# EAGLE schematic RecoveryBoard (EAGLE 9.4.2)

## Sheet 1 of 2: Power
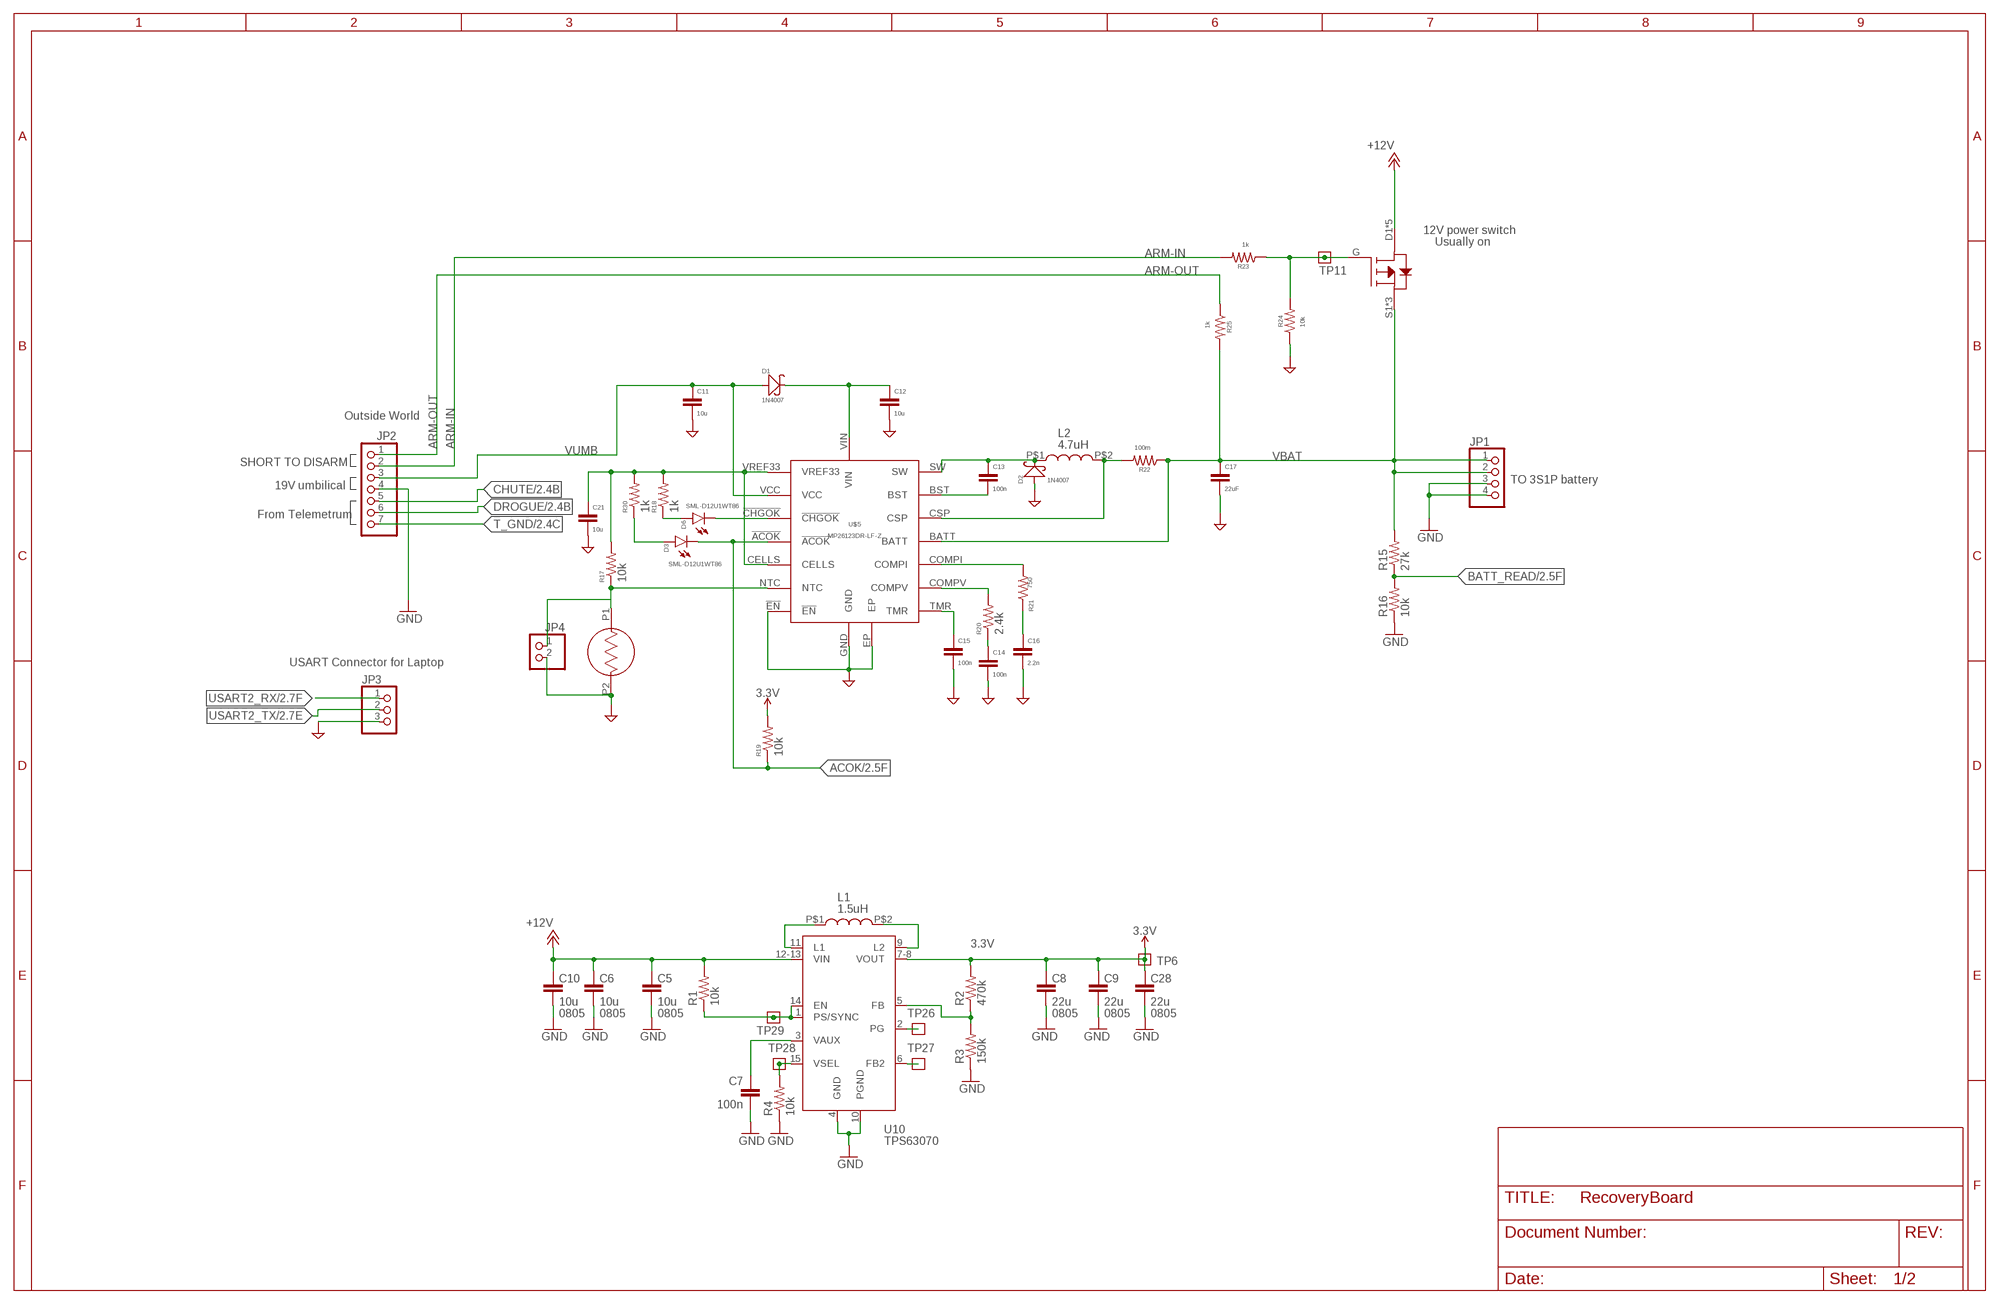
[diagram p0: schematic, sheet 1]

### Parts
C5  10u  C-EU0805-C-NOSILK  [.0805-C-NOSILK]
C6  10u  C-EU0805-C-NOSILK  [.0805-C-NOSILK]
C7  100n  C-EU0603-C-NOSILK  [.0603-C-NOSILK]
C8  22u  C-EU0805-C-NOSILK  [.0805-C-NOSILK]
C9  22u  C-EU0805-C-NOSILK  [.0805-C-NOSILK]
C10  10u  C-EU0805-C-NOSILK  [.0805-C-NOSILK]
C11  10u  C-EU0805-C-NOSILK  [.0805-C-NOSILK]
C12  10u  C-EU0805-C-NOSILK  [.0805-C-NOSILK]
C13  100n  C-EU0603-C-NOSILK  [.0603-C-NOSILK]
C14  100n  C-EU0603-C-NOSILK  [.0603-C-NOSILK]
C15  100n  C-EU0603-C-NOSILK  [.0603-C-NOSILK]
C16  2.2n  C-EU0603-C-NOSILK  [.0603-C-NOSILK]
C17  22uF  C-EU0805-C-NOSILK  [.0805-C-NOSILK]
C21  10u  C-EU0805-C-NOSILK  [.0805-C-NOSILK]
C28  22u  C-EU0805-C-NOSILK  [.0805-C-NOSILK]
D1  1N4007  DIODE-SCHOTTKY-(DO-214AC)  [DO-214AC]
D2  1N4007  DIODE-SCHOTTKY-(DO-214AC)  [DO-214AC]
D3  SML-D12U1WT86  LEDCHIPLED_0603  [CHIPLED_0603]
D6  SML-D12U1WT86  LEDCHIPLED_0603  [CHIPLED_0603]
JP1  PINHD-1X4  [1X04]
JP2  PINHD-1X7  [1X07]
JP3  PINHD-1X3  [1X03]
JP4  PINHD-1X2  [1X02]
L1  1.5uH  IHLP2020CZER1R5M11  [IHLP2020CZER1R5M11]
L2  4.7uH  IHLP2020BZER4R7M11  [IHLP2020BZER4R7M11]
Q7  SI7465DP-T1-E3  [SI7465DP-T1-E3CT-ND]
R1  10k  R-US_0603-C-NOSILK  [.0603-C-NOSILK]
R2  470k  R-US_0603-C-NOSILK  [.0603-C-NOSILK]
R3  150k  R-US_0603-C-NOSILK  [.0603-C-NOSILK]
R4  10k  R-US_0603-C-NOSILK  [.0603-C-NOSILK]
R5  NHQ103B375T10  [NHQ103B375T10]
R15  27k  R-US_0603-C-NOSILK  [.0603-C-NOSILK]
R16  10k  R-US_0603-C-NOSILK  [.0603-C-NOSILK]
R17  10k  R-US_0603-C-NOSILK  [.0603-C-NOSILK]
R18  1k  R-US_0603-C-NOSILK  [.0603-C-NOSILK]
R19  10k  R-US_0603-C-NOSILK  [.0603-C-NOSILK]
R20  2.4k  R-US_0603-C-NOSILK  [.0603-C-NOSILK]
R21  750  R-US_0603-C-NOSILK  [.0603-C-NOSILK]
R22  100m  R-US_1206-C  [1206-C]
R23  1k  R-US_0603-C-NOSILK  [.0603-C-NOSILK]
R24  10k  R-US_0603-C-NOSILK  [.0603-C-NOSILK]
R25  1k  R-US_0603-C-NOSILK  [.0603-C-NOSILK]
R30  1k  R-US_0603-C-NOSILK  [.0603-C-NOSILK]
TP6  TEST-POINT  [2MM-TEST-POINT]
TP11  TEST-POINT  [2MM-TEST-POINT]
TP26  TEST-POINT  [2MM-TEST-POINT]
TP27  TEST-POINT  [2MM-TEST-POINT]
TP28  TEST-POINT  [2MM-TEST-POINT]
TP29  TEST-POINT  [2MM-TEST-POINT]
U10  TPS63070  TPS63070X  [TPS63070X]
U$5  MP26123DR-LF-Z  [MP26123DR-LF-Z]

### Nets
3.3V: C8.1 C9.1 C28.1 R2.2 R19.2 TP6.1 U10.7-8(VOUT) ; also sheet 2
!BEN: C12.1 D1.2(-) U$5.VIN
+12V: C5.1 C6.1 C10.1 Q7.D1(D) Q7.D2(D) Q7.D3(D) Q7.D4(D) Q7.DPAD(D) R1.2 U10.12-13(VIN) ; also sheet 2
ACOK: D3.C R19.1 U$5.!ACOK ; also sheet 2
ARM-IN: JP2.2 R23.2
ARM-OUT: JP2.1 R25.1
BATT_READ: R15.1 R16.2 ; also sheet 2
CHUTE: JP2.5 ; also sheet 2
DROGUE: JP2.6 ; also sheet 2
GND: C5.2 C6.2 C7.2 C8.2 C9.2 C10.2 C11.2 C12.2 C14.2 C15.2 C16.2 C17.2 C21.2 C28.2 D2.1(+) JP1.3 JP1.4 JP2.4 JP3.3 JP4.2 R3.1 R4.1 R5.P2 R16.1 R24.1 U10.4(GND) U10.10(PGND) U$5.!EN U$5.EP U$5.GND ; also sheet 2
N$10: C13.1 D2.2(-) L2.P$1 U$5.SW
N$11: C13.2 U$5.BST
N$12: C21.1 R17.2 R18.2 R30.2 U$5.CELLS U$5.VREF33
N$13: D6.C U$5.!CHGOK
N$14: D3.A R30.1
N$16: Q7.G R23.1 R24.2 TP11.1
N$17: D6.A R18.1
N$18: R20.2 U$5.COMPV
N$19: C15.1 U$5.TMR
N$20: JP4.1 R5.P1 R17.1 U$5.NTC
N$21: R21.2 U$5.COMPI
N$22: C16.1 R21.1
N$28: L2.P$2 R22.2 U$5.CSP
N$30: C14.1 R20.1
T_GND: JP2.7 ; also sheet 2
TPS-EN: R1.1 TP29.1 U10.1(PS/SYNC) U10.14(EN)
TPS-FB: R2.1 R3.2 U10.5(FB)
TPS-FB2: TP27.1 U10.6(FB2)
TPS-L1: L1.P$1 U10.11(L1)
TPS-L2: L1.P$2 U10.9(L2)
TPS-PG: TP26.1 U10.2(PG)
TPS-VAUX: C7.1 U10.3(VAUX)
TPS-VSEL: R4.2 TP28.1 U10.15(VSEL)
USART2_RX: JP3.1 ; also sheet 2
USART2_TX: JP3.2 ; also sheet 2
VBAT: C17.1 JP1.1 JP1.2 Q7.S1(S) Q7.S2(S) Q7.S3(S) R15.2 R22.1 R25.2 U$5.BATT
VUMB: C11.1 D1.1(+) JP2.3 U$5.VCC

### Notes on the sheet
- 12V power switch
- Usually on
- Outside World
- SHORT TO DISARM
- TO 3S1P battery
- 19V umbilical
- From Telemetrum
- USART Connector for Laptop
- 0805 | 0805 | 0805 | 0805 | 0805 | 0805

## Sheet 2 of 2: Microcontroller
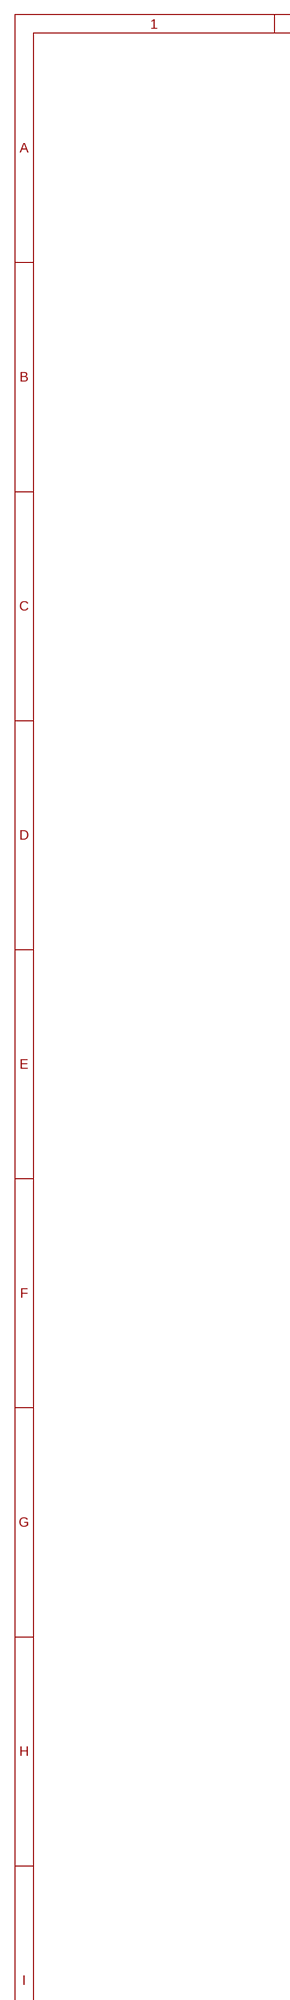
[diagram p1: schematic, sheet 2, part 1 of 2]
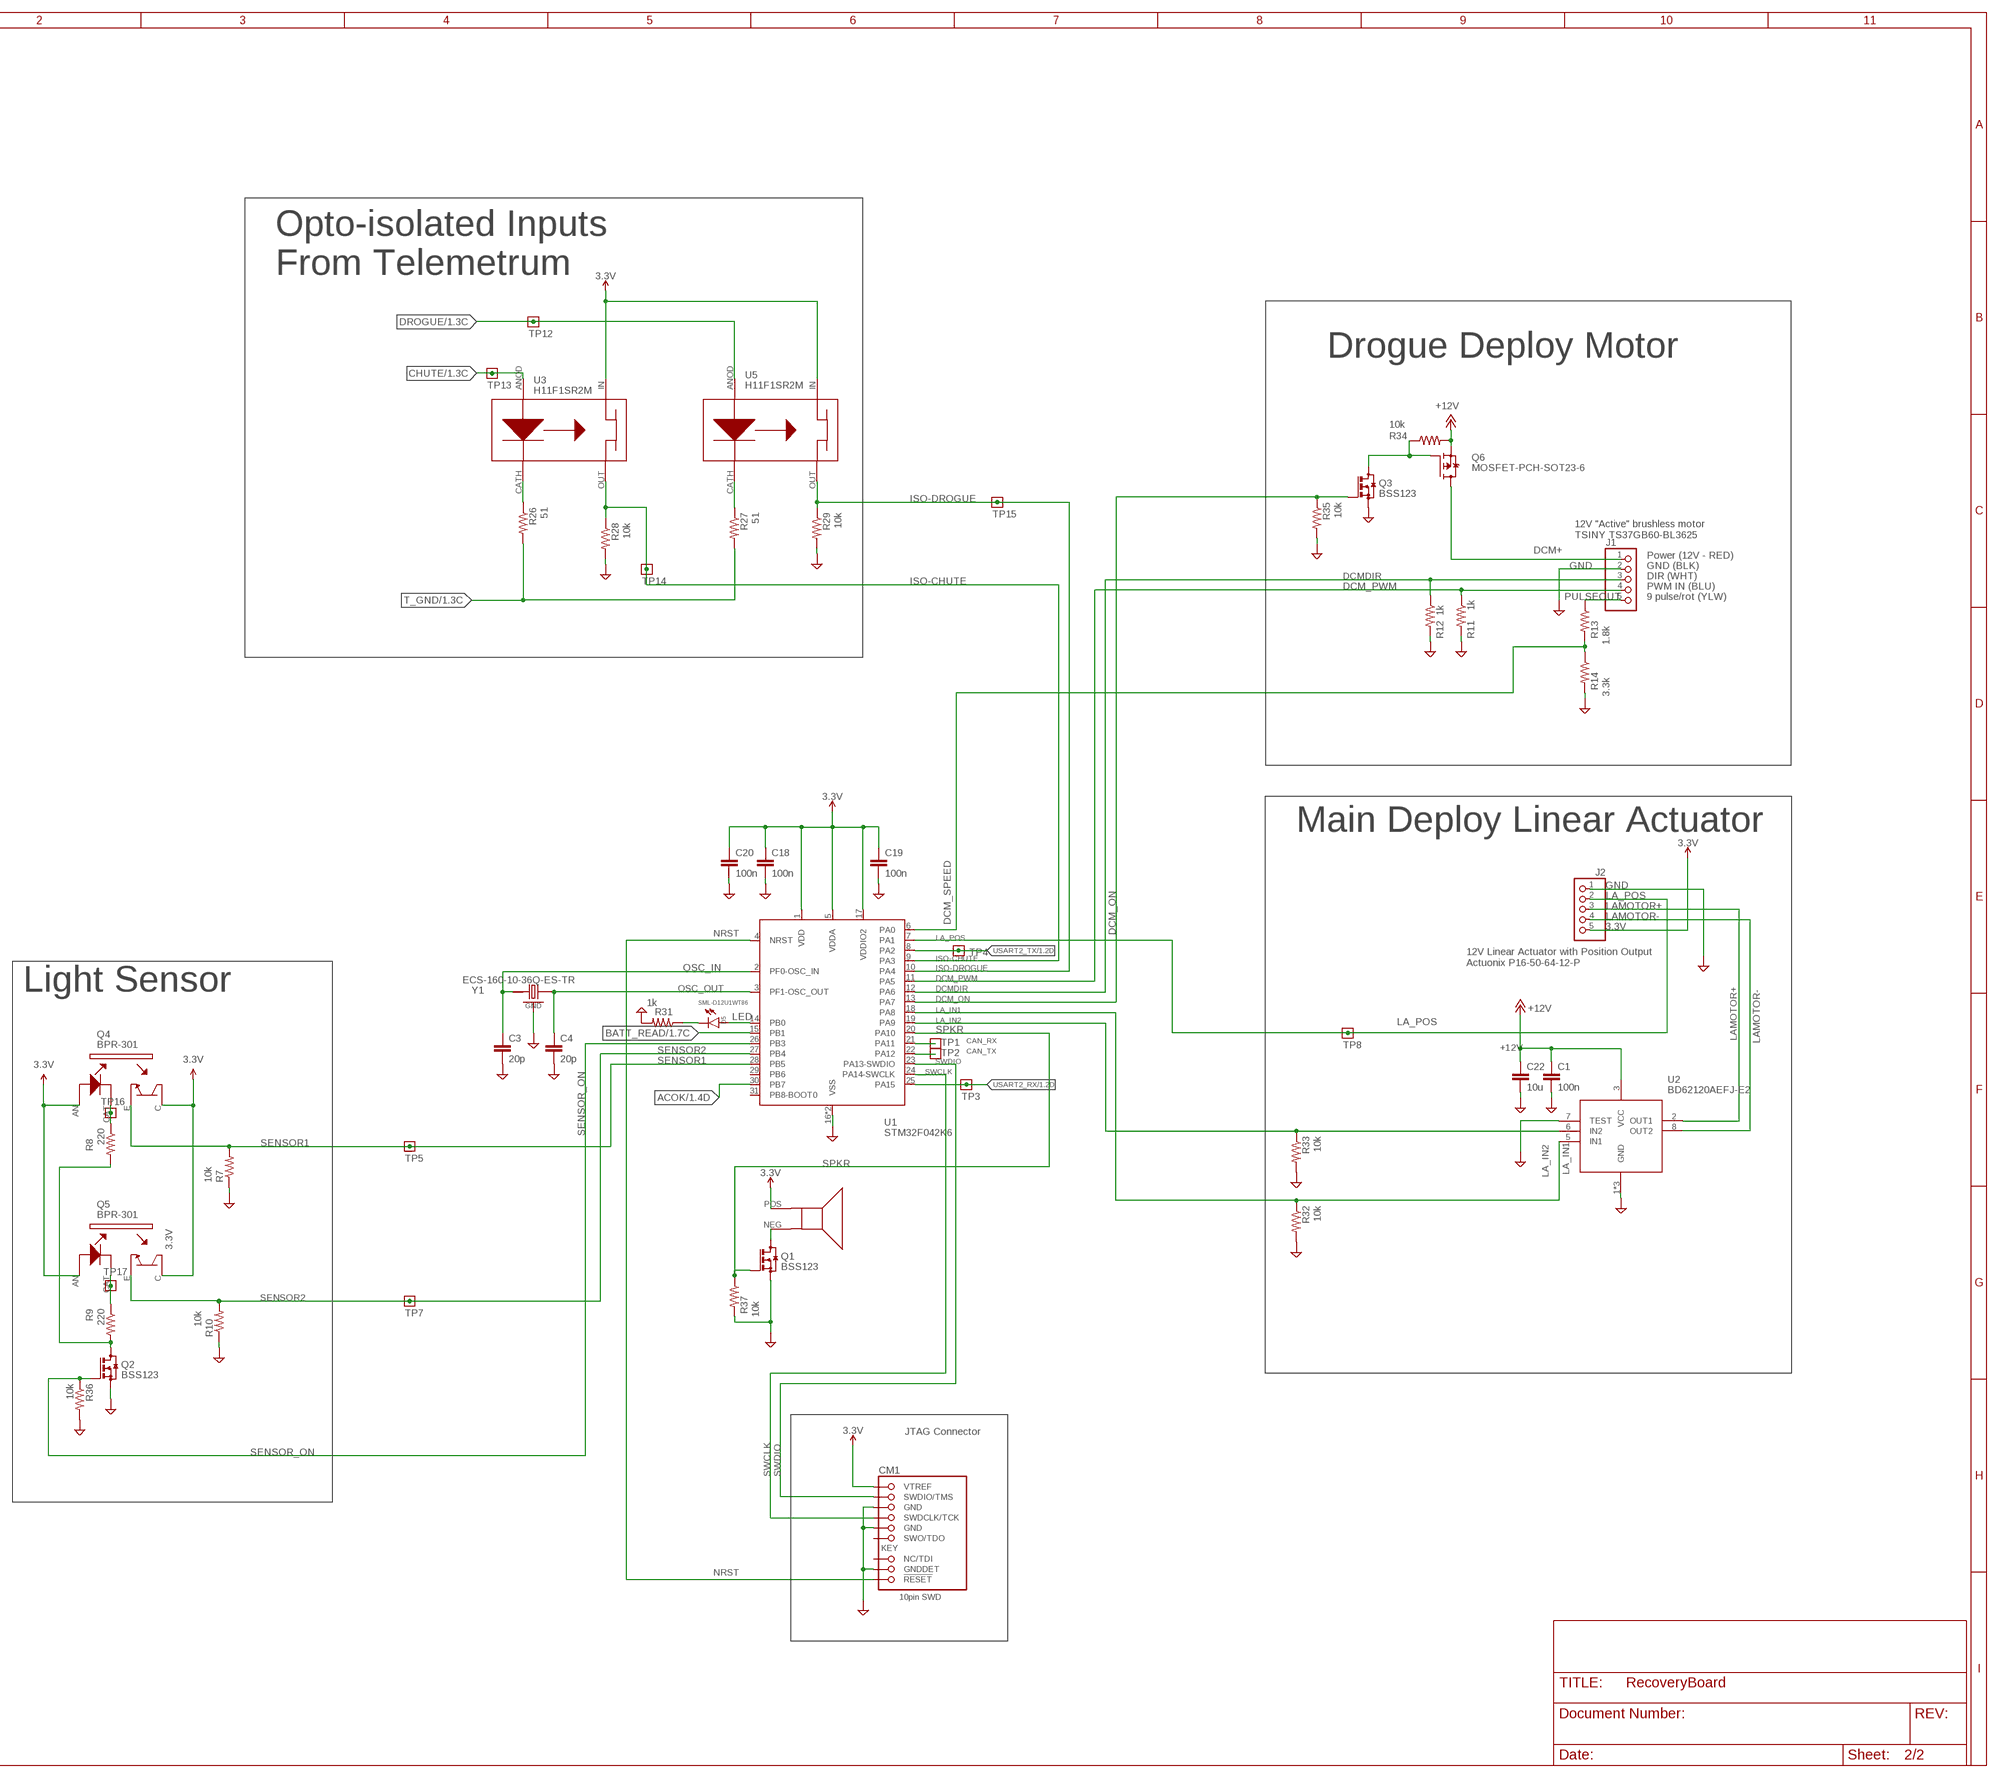
[diagram p2: schematic, sheet 2, part 2 of 2]

### Parts
C1  100n  C-EU0603-C-NOSILK  [.0603-C-NOSILK]
C3  20p  C-EU0603-C-NOSILK  [.0603-C-NOSILK]
C4  20p  C-EU0603-C-NOSILK  [.0603-C-NOSILK]
C18  100n  C-EU0603-C-NOSILK  [.0603-C-NOSILK]
C19  100n  C-EU0603-C-NOSILK  [.0603-C-NOSILK]
C20  100n  C-EU0603-C-NOSILK  [.0603-C-NOSILK]
C22  10u  C-EU0805-A-NOSILK  [.0805-A-NOSILK]
CM1  FTSH-105-XX-X-DV-K  [CON10_2X5_DUK_FTSH]
D5  SML-D12U1WT86  LEDCHIPLED_0603  [CHIPLED_0603]
J1  PINHD-1X5  [1X05]
J2  PINHD-1X5  [1X05]
Q1  BSS123  [SOT23]
Q2  BSS123  [SOT23]
Q3  BSS123  [SOT23]
Q4  BPR-301  [BPR-301]
Q5  BPR-301  [BPR-301]
Q6  MOSFET-PCH-SOT23-6  [SOT23-6]
R7  10k  R-US_0603-C-NOSILK  [.0603-C-NOSILK]
R8  220  R-US_0603-C-NOSILK  [.0603-C-NOSILK]
R9  220  R-US_0603-C-NOSILK  [.0603-C-NOSILK]
R10  10k  R-US_0603-C-NOSILK  [.0603-C-NOSILK]
R11  1k  R-US_0603-C-NOSILK  [.0603-C-NOSILK]
R12  1k  R-US_0603-C-NOSILK  [.0603-C-NOSILK]
R13  1.8k  R-US_0603-C-NOSILK  [.0603-C-NOSILK]
R14  3.3k  R-US_0603-C-NOSILK  [.0603-C-NOSILK]
R26  51  R-US_0603-C-NOSILK  [.0603-C-NOSILK]
R27  51  R-US_0603-C-NOSILK  [.0603-C-NOSILK]
R28  10k  R-US_0603-C-NOSILK  [.0603-C-NOSILK]
R29  10k  R-US_0603-C-NOSILK  [.0603-C-NOSILK]
R31  1k  R-US_0603-C-NOSILK  [.0603-C-NOSILK]
R32  10k  R-US_0603-C-NOSILK  [.0603-C-NOSILK]
R33  10k  R-US_0603-C-NOSILK  [.0603-C-NOSILK]
R34  10k  R-US_0603-C-NOSILK  [.0603-C-NOSILK]
R35  10k  R-US_0603-C-NOSILK  [.0603-C-NOSILK]
R36  10k  R-US_0603-C-NOSILK  [.0603-C-NOSILK]
R37  10k  R-US_0603-C-NOSILK  [.0603-C-NOSILK]
TP1  TEST-POINT  [2MM-TEST-POINT]
TP2  TEST-POINT  [2MM-TEST-POINT]
TP3  TEST-POINT  [2MM-TEST-POINT]
TP4  TEST-POINT  [2MM-TEST-POINT]
TP5  TEST-POINT  [2MM-TEST-POINT]
TP7  TEST-POINT  [2MM-TEST-POINT]
TP8  TEST-POINT  [2MM-TEST-POINT]
TP12  TEST-POINT  [2MM-TEST-POINT]
TP13  TEST-POINT  [2MM-TEST-POINT]
TP14  TEST-POINT  [2MM-TEST-POINT]
TP15  TEST-POINT  [2MM-TEST-POINT]
TP16  TEST-POINT  [2MM-TEST-POINT]
TP17  TEST-POINT  [2MM-TEST-POINT]
U1  STM32F042K6  [QFP32-7X7]
U2  BD62120AEFJ-E2  [SOIC127P600X100-9N]
U3  H11F1SR2M  [H11F1SR2M]
U5  H11F1SR2M  [H11F1SR2M]
U$7  SMT-0440-S-R  [SMT-0440-S-R]
Y1  ECS-160-10-36Q-ES-TR  [XTAL_ECS-160-10-36Q-ES-TR]

### Nets
3.3V: C18.1 C19.1 C20.1 CM1.1(VTREF) J2.5 Q4.AN(ANOD) Q4.C(COLL) Q5.AN(ANOD) Q5.C(COLL) U1.1(VDD) U1.5(VDDA) U1.17(VDDIO2) U3.IN U5.IN U$7.POS ; also sheet 1
+12V: C1.1 C22.1 Q6.4(S) R34.2 U2.3(VCC) ; also sheet 1
ACOK: U1.30(PB7) ; also sheet 1
BATT_READ: U1.15(PB1) ; also sheet 1
CAN_RX: TP1.1 U1.21(PA11)
CAN_TX: TP2.1 U1.22(PA12)
CHUTE: TP13.1 U3.ANOD ; also sheet 1
DCM+: J1.1 Q6.1(D) Q6.2(D) Q6.5(D) Q6.6(D)
DCM_ON: Q3.1(G) R35.1 U1.13(PA7)
DCM_PWM: J1.4 R11.1 U1.11(PA5)
DCM_SPEED: R13.2 R14.1 U1.6(PA0)
DCMDIR: J1.3 R12.1 U1.12(PA6)
DROGUE: TP12.1 U5.ANOD ; also sheet 1
GND: C1.2 C3.2 C4.2 C18.2 C19.2 C20.2 C22.2 CM1.3(GND) CM1.5(GND) CM1.9(GNDDET) J1.2 J2.1 Q1.2(S) Q2.2(S) Q3.2(S) R7.1 R10.1 R11.2 R12.2 R14.2 R28.2 R29.2 R31.2 R32.2 R33.2 R35.2 R36.2 R37.2 U1.16(VSS) U1.32(VSS) U2.1(GND) U2.4(GND) U2.7(TEST) U2.9(GND) Y1.GND Y1.GND2(GND) ; also sheet 1
ISO-CHUTE: R28.1 TP14.1 U1.9(PA3) U3.OUT
ISO-DROGUE: R29.1 TP15.1 U1.10(PA4) U5.OUT
LA_IN1: R32.1 U1.18(PA8) U2.5(IN1)
LA_IN2: R33.1 U1.19(PA9) U2.6(IN2)
LA_POS: J2.2 TP8.1 U1.7(PA1)
LAMOTOR+: J2.3 U2.2(OUT1)
LAMOTOR-: J2.4 U2.8(OUT2)
LED: D5.A U1.14(PB0)
N$1: Q1.3(D) U$7.NEG
N$2: Q4.CAT(CATH) R8.1 TP16.1
N$4: D5.C R31.1
N$5: Q5.CAT(CATH) R9.1 TP17.1
N$6: Q3.3(D) Q6.3(G) R34.1
N$7: R26.1 U3.CATH(CAT)
N$26: R27.1 U5.CATH(CAT)
N$27: Q2.3(D) R8.2 R9.2
NRST: CM1.10(!RESET) U1.4(NRST)
OSC_IN: C3.1 U1.2(PF0-OSC_IN) Y1.IN/OUT
OSC_OUT: C4.1 U1.3(PF1-OSC_OUT) Y1.OUT/IN
PULSEOUT: J1.5 R13.1
SENSOR1: Q4.E(EMIT) R7.2 TP5.1 U1.28(PB5)
SENSOR2: Q5.E(EMIT) R10.2 TP7.1 U1.27(PB4)
SENSOR_ON: Q2.1(G) R36.1 U1.26(PB3)
SPKR: Q1.1(G) R37.1 U1.20(PA10)
SWCLK: CM1.4(SWDCLK/TCK) U1.24(PA14-SWCLK)
SWDIO: CM1.2(SWDIO/TMS) U1.23(PA13-SWDIO)
T_GND: R26.2 R27.2 ; also sheet 1
USART2_RX: TP3.1 U1.25(PA15) ; also sheet 1
USART2_TX: TP4.1 U1.8(PA2) ; also sheet 1
Unconnected: CM1.6(SWO/TDO) CM1.8(NC/TDI) U1.29(PB6) U1.31(PB8-BOOT0)

### Notes on the sheet
- Opto-isolated Inputs
  From Telemetrum
- Drogue Deploy Motor
- 12V "Active" brushless motor
  TSINY TS37GB60-BL3625
- Power (12V - RED)
- GND (BLK)
- DIR (WHT)
- PWM IN (BLU)
- 9 pulse/rot (YLW)
- Main Deploy Linear Actuator
- 12V Linear Actuator with Position Output
  Actuonix P16-50-64-12-P
- Light Sensor
- JTAG Connector

## Library data of the parts
C1 C3 C4 C6 C9-C22 C28 = oresat-rcl:C-EU: CAPACITOR, European symbol
C5 C7 C8 = oresat-rcl:C-EU: CAPACITOR, European symbol; DIS: Digi-Key; DPN: 1276-1001-1-ND; MFR: Samsung; MPN: CL05B104KO5NNNC
CM1 = J-Samtec-FTSH-105-XXX-DV-K-ARM-SWD:FTSH-105-XX-X-DV-K
D1 D2 = D-Generic-Schottky-DO-214AC-SMA:DIODE-SCHOTTKY-(DO-214AC): 304010013; MPN: 1N4007
D3 D5 D6 = led:LED: LED OSRAM: - CHIPLED LG R971, LG N971, LY N971, LG Q971, LY Q971, LO R971, LY R971 LH N974, LH R974 LS Q976, LO Q976, LY Q976 LO Q996 - Hyper CHIPLED LW Q18S LB Q993, LB Q99A, LB R99A - SideLED LS A670, LO A670, LY A670, LG A670, LP A670 LB A673, LV A673, LT A673, LW A673 LH A674 LY A675 LS A676, LA A676, LO A676, LY A676, LW A676 LS A679, LY A679, LG A679 - Hyper Micro SIDELED® LS Y876, LA Y876, LO Y876, LY Y876 LT Y87S - SmartLED LW L88C, LW L88S LB L89C, LB L89S, LG L890 LS L89K, LO L89K, LY L89K LS L896, LA L896, LO L896, LY L896 - TOPLED LS T670, LO T670, LY T670, LG T670, LP T670 LSG T670, LSP T670, LSY T670, LOP T670, LYG T670 LG T671, LOG T671, LSG T671 LB T673, LV T673, LT T673, LW T673 LH T674 LS T676, LA T676, LO T676, LY T676, LB T676, LH T676, LSB T676, LW T676 LB T67C, LV T67C, LT T67C, LS T67K, LO T67K, LY T67K, LW E67C LS E67B, LA E67B, LO E67B, LY E67B, LB E67C, LV E67C, LT E67C LW T67C LS T679, LY T679, LG T679 LS T770, LO T770, LY T770, LG T770, LP T770 LB T773, LV T773, LT T773, LW T773 LH T774 LS E675, LA E675, LY E675, LS T675 LS T776, LA T776, LO T776, LY T776, LB T776 LHGB T686 LT T68C, LB T68C - Hyper Mini TOPLED® LB M676 - Mini TOPLED Santana® LG M470 LS M47K, LO M47K, LY M47K Source: http://www.osram.convergy.de LUXEON: - LUMILED® LXK2-PW12-R00, LXK2-PW12-S00, LXK2-PW14-U00, LXK2-PW14-V00 LXK2-PM12-R00, LXK2-PM12-S00, LXK2-PM14-U00 LXK2-PE12-Q00, LXK2-PE12-R00, LXK2-PE12-S00, LXK2-PE14-T00, LXK2-PE14-U00 LXK2-PB12-K00, LXK2-PB12-L00, LXK2-PB12-M00, LXK2-PB14-N00, LXK2-PB14-P00, LXK2-PB14-Q00 LXK2-PR12-L00, LXK2-PR12-M00, LXK2-PR14-Q00, LXK2-PR14-R00 LXK2-PD12-Q00, LXK2-PD12-R00, LXK2-PD12-S00 LXK2-PH12-R00, LXK2-PH12-S00 LXK2-PL12-P00, LXK2-PL12-Q00, LXK2-PL12-R00 Source: www.luxeon.com KINGBRIGHT: KA-3528ASYC Source: www.kingbright.com; DIS: Digikey; DPN: SML-D12U1WT86CT-ND; MPN: SML-D12U1WT86
J1 J2 = pinhead:PINHD-1X5: PIN HEADER
JP1 = pinhead:PINHD-1X4: PIN HEADER
JP2 = pinhead:PINHD-1X7: PIN HEADER
JP3 = pinhead:PINHD-1X3: PIN HEADER
JP4 = pinhead:PINHD-1X2: PIN HEADER
L1 = L--IHLP2020CZER1R5M11--1.5uHInductor:IHLP2020CZER1R5M11; DIS: Digi-Key; DPN: 541-1222-1-ND; MFR: Vishay Dale; MPN: IHLP2020BZER4R7M11
L2 = L--IHLP2020BZER4R7M11--4.7uInductor:IHLP2020BZER4R7M11; DIS: Digi-Key; DPN: 541-1222-1-ND; MFR: Vishay Dale; MPN: IHLP2020BZER4R7M11
Q1-Q3 = transistor-small-signal:BSS123: N-CHANNEL MOS FET
Q4 Q5 = Q--BPR-301--Phototransistor:BPR-301; DATASHEET: http://americanbrightled.com/pdffiles/infrared/BPR-301.pdf; DIS: DigiKey; DPN: BPR-301-ND; MPN: BPR-301
Q6 = Q-MOSFET-PCH-SOT23-6:MOSFET-PCH-SOT23-6: P channel MOSFET in an SOT23-6
Q7 = Q--Si7465DP--Vishay Power MOSFET with multple S+D leads:SI7465DP-T1-E3; DIS: DigiKey; DPN: SI7465DP-T1-E3CT-ND; MFR: Vishay Siliconix; MPN: SI7465DP-T1-E3
R1-R4 R15 R16 = oresat-rcl:R-US_: RESISTOR, American symbol; DIS: Digi-Key; DPN: 1276-4275-1-ND; MFR: Samsung; MPN: RC1005F6653CS
R5 = R--NHQ103B375T10--Thermistor 10K:NHQ103B375T10
R7-R14 R17-R37 = oresat-rcl:R-US_: RESISTOR, American symbol
TP1-TP8 TP11-TP17 TP26-TP29 = Tova:TEST-POINT
U1 = U-ST-STM32F042K-uC:STM32F042K6
U2 = SamacSys_Parts:BD62120AEFJ-E2: ROHM BD62120AEFJ-E2 Motor Driver IC 8-Pin, HTSOP-J Source: Datasheet <https://componentsearchengine.com/Datasheets/1/BD62120AEFJ-E2.pdf>; DESCRIPTION: ROHM BD62120AEFJ-E2 Motor Driver IC 8-Pin, HTSOP-J; HEIGHT: 1mm; MANUFACTURER_NAME: ROHM Semiconductor; MANUFACTURER_PART_NUMBER: BD62120AEFJ-E2; MOUSER_PART_NUMBER: 755-BD62120AEFJ-E2; MOUSER_PRICE-STOCK: https://www.mouser.com/Search/Refine.aspx?Keyword=755-BD62120AEFJ-E2
U3 U5 = Q--H11F1SR2M--OptoIsolator:H11F1SR2M
U10 = ic-pwr-tps63070x:TPS63070X: TPS63070 2-V to 16-V Buck-Boost Converter With 3.6-A Switch Current
U$5 = U--MP26123DR-LF-Z--LiPo Charger:MP26123DR-LF-Z
U$7 = SPK--SMT-0440-S-R--Speaker:SMT-0440-S-R
Y1 = ECS-160-10-36Q-ES-TR:ECS-160-10-36Q-ES-TR: The ECX-2236Q is a miniature SMD Crystal with a 2.5 x 2.0 mm; DESCRIPTION: Crystal 16MHz ±30ppm _Tol_ ±50ppm _Stability_ 10pF FUND 80Ohm Automotive 4-Pin SMD T/R; DIGI-KEY_PART_NUMBER: XC2181CT-ND; DIGI-KEY_PURCHASE_URL: https://www.digikey.com/product-detail/en/ecs-inc/ECS-160-10-36Q-ES-TR/XC2181CT-ND/6134150?utm_source=snapeda&utm_medium=aggregator&utm_campaign=symbol; MF: ECS Inc.; MP: ECS-160-10-36Q-ES-TR; PACKAGE: SMD-4 ECS International